# EAGLE design letter_i (EAGLE 9.5.2)
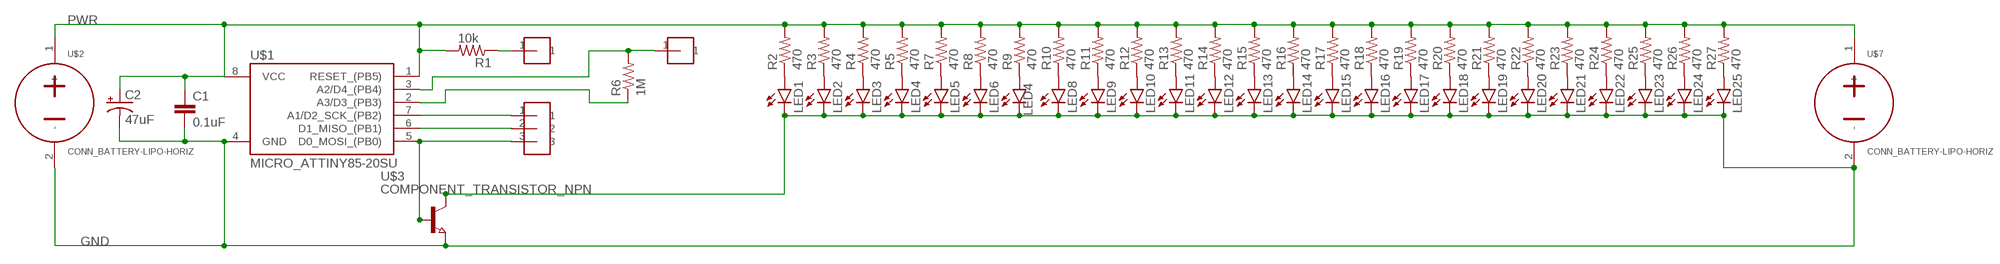
[diagram p0: schematic, sheet 1]

## Parts
C1  0.1uF  COMPONENT_CAP-0805  [0805]
C2  47uF  COMPONENT_CAP_POL-6.3MM  [CAP_RADIAL_CAN_10MM]
LED1  LED-0805  [CHIP-LED0805]
LED2  LED-0805  [CHIP-LED0805]
LED3  LED-0805  [CHIP-LED0805]
LED4  LED-0805  [CHIP-LED0805]
LED5  LED-0805  [CHIP-LED0805]
LED6  LED-0805  [CHIP-LED0805]
LED7  LED-0805  [CHIP-LED0805]
LED8  LED-0805  [CHIP-LED0805]
LED9  LED-0805  [CHIP-LED0805]
LED10  LED-0805  [CHIP-LED0805]
LED11  LED-0805  [CHIP-LED0805]
LED12  LED-0805  [CHIP-LED0805]
LED13  LED-0805  [CHIP-LED0805]
LED14  LED-0805  [CHIP-LED0805]
LED15  LED-0805  [CHIP-LED0805]
LED16  LED-0805  [CHIP-LED0805]
LED17  LED-0805  [CHIP-LED0805]
LED18  LED-0805  [CHIP-LED0805]
LED19  LED-0805  [CHIP-LED0805]
LED20  LED-0805  [CHIP-LED0805]
LED21  LED-0805  [CHIP-LED0805]
LED22  LED-0805  [CHIP-LED0805]
LED23  LED-0805  [CHIP-LED0805]
LED24  LED-0805  [CHIP-LED0805]
LED25  LED-0805  [CHIP-LED0805]
R1  10k  COMPONENT_RESISTOR-0805  [0805]
R2  470  COMPONENT_RESISTOR-0805  [0805]
R3  470  COMPONENT_RESISTOR-0805  [0805]
R4  470  COMPONENT_RESISTOR-0805  [0805]
R5  470  COMPONENT_RESISTOR-0805  [0805]
R6  1M  COMPONENT_RESISTOR-0805  [0805]
R7  470  COMPONENT_RESISTOR-0805  [0805]
R8  470  COMPONENT_RESISTOR-0805  [0805]
R9  470  COMPONENT_RESISTOR-0805  [0805]
R10  470  COMPONENT_RESISTOR-0805  [0805]
R11  470  COMPONENT_RESISTOR-0805  [0805]
R12  470  COMPONENT_RESISTOR-0805  [0805]
R13  470  COMPONENT_RESISTOR-0805  [0805]
R14  470  COMPONENT_RESISTOR-0805  [0805]
R15  470  COMPONENT_RESISTOR-0805  [0805]
R16  470  COMPONENT_RESISTOR-0805  [0805]
R17  470  COMPONENT_RESISTOR-0805  [0805]
R18  470  COMPONENT_RESISTOR-0805  [0805]
R19  470  COMPONENT_RESISTOR-0805  [0805]
R20  470  COMPONENT_RESISTOR-0805  [0805]
R21  470  COMPONENT_RESISTOR-0805  [0805]
R22  470  COMPONENT_RESISTOR-0805  [0805]
R23  470  COMPONENT_RESISTOR-0805  [0805]
R24  470  COMPONENT_RESISTOR-0805  [0805]
R25  470  COMPONENT_RESISTOR-0805  [0805]
R26  470  COMPONENT_RESISTOR-0805  [0805]
R27  470  COMPONENT_RESISTOR-0805  [0805]
U$1  MICRO_ATTINY85-20SU  [SOIC8]
U$2  CONN_BATTERY-LIPO-HORIZ  [JST-PH-2-SMT-RA]
U$3  COMPONENT_TRANSISTOR_NPN  [SOT23]
U$4  HEADER-1-TESTPOINT  [TESTPOINT-1]
U$5  HEADER-1-TESTPOINT  [TESTPOINT-1]
U$6  HEADER-3-TESTPOINT  [TESTPOINT-3]
U$7  CONN_BATTERY-LIPO-HORIZ  [JST-PH-2-SMT-RA]

## Nets
GND: C1.2 C2.- LED1.C LED2.C LED3.C LED4.C LED5.C LED6.C LED7.C LED8.C LED9.C LED10.C LED11.C LED12.C LED13.C LED14.C LED15.C LED16.C LED17.C LED18.C LED19.C LED20.C LED21.C LED22.C LED23.C LED24.C LED25.C U$1.4(GND) U$2.2(-) U$3.2(E) U$3.3(C) U$7.2(-)
N$3: LED1.A R2.1
N$4: LED2.A R3.1
N$5: LED3.A R4.1
N$6: U$1.5(D0_MOSI_(PB0)) U$3.1(B) U$6.3
N$7: LED4.A R5.1
N$8: LED5.A R7.1
N$9: LED6.A R8.1
N$10: R6.2 U$1.3(A2/D4_(PB4)) U$4.1
N$11: R1.1 U$5.1
N$12: LED7.A R9.1
N$13: U$1.7(A1/D2_SCK_(PB2)) U$6.1
N$14: U$1.6(D1_MISO_(PB1)) U$6.2
N$15: LED8.A R10.1
N$16: R6.1 U$1.2(A3/D3_(PB3))
N$17: LED9.A R11.1
N$18: LED10.A R12.1
N$19: LED11.A R13.1
N$20: LED12.A R14.1
N$21: LED13.A R15.1
N$22: LED14.A R16.1
N$23: LED15.A R17.1
N$24: LED16.A R18.1
N$25: LED17.A R19.1
N$26: LED18.A R20.1
N$27: LED19.A R21.1
N$28: LED20.A R22.1
N$29: LED21.A R23.1
N$30: LED22.A R24.1
N$31: LED23.A R25.1
N$32: LED24.A R26.1
N$33: LED25.A R27.1
PWR: C1.1 C2.+ R1.2 R2.2 R3.2 R4.2 R5.2 R7.2 R8.2 R9.2 R10.2 R11.2 R12.2 R13.2 R14.2 R15.2 R16.2 R17.2 R18.2 R19.2 R20.2 R21.2 R22.2 R23.2 R24.2 R25.2 R26.2 R27.2 U$1.1(RESET_(PB5)) U$1.8(VCC) U$2.1(+) U$7.1(+)

## Library data of the parts
C1 = homemade-hardware:COMPONENT_CAP: Capacitor Standard 0603 ceramic capacitor, and 0.1" leaded capacitor.
C2 = homemade-hardware:COMPONENT_CAP_POL: Capacitor Polarized These are standard SMD and PTH capacitors. Normally 47uF, 100uF, and 470uF in electrolytic and tantalum varieties. Always verify the external diameter of the through hole cap, it varies with capacity, voltage, and manufacturer. The EIA devices should be standard.
LED1-LED25 = homemade-hardware:LED: LEDs Standard schematic elements and footprints for 5mm, 3mm, 1206, and 0603 sized LEDs. 5mm - Spark Fun Electronics SKU : COM-00529 (and others)
R1-R27 = homemade-hardware:COMPONENT_RESISTOR
U$1 = homemade-hardware:MICRO_ATTINY85
U$2 U$7 = homemade-hardware:CONN_BATTERY
U$3 = homemade-hardware:COMPONENT_TRANSISTOR_NPN: BSS806NH6327XTSA1 <https://www.digikey.com/product-detail/en/infineon-technologies/BSS806NH6327XTSA1/BSS806NH6327XTSA1DKR-ND/3196843>: NPN Moseft Transistor - 20V 2.3A; PN: BSS806NH6327XTSA1
U$4 U$5 = homemade-hardware:HEADER-1: M20-8890845 <https://www.digikey.com/products/en?keywords=952-3236-ND>: Horizontal Male SMD Headers M20-7910842R <https://www.digikey.com/product-detail/en/harwin-inc/M20-7910842R/952-3200-6-ND/6559341>: Horizontal Female SMD Headers
U$6 = homemade-hardware:HEADER-3: NPTC081KFXC-RC <https://www.digikey.com/product-detail/en/sullins-connector-solutions/NPTC081KFXC-RC/S5600-ND/776058>: Vertical Female SMD Headers TSM-110-01-T-SV <https://www.digikey.com/product-detail/en/samtec-inc/TSM-110-01-T-SV/SAM12267-ND/6691889>: Vertical Male SMD Headers M20-8890845 <https://www.digikey.com/products/en?keywords=952-3236-ND>: Horizontal Male SMD Headers M20-7910842R <https://www.digikey.com/product-detail/en/harwin-inc/M20-7910842R/952-3200-6-ND/6559341>: Horizontal Female SMD Headers

## Board
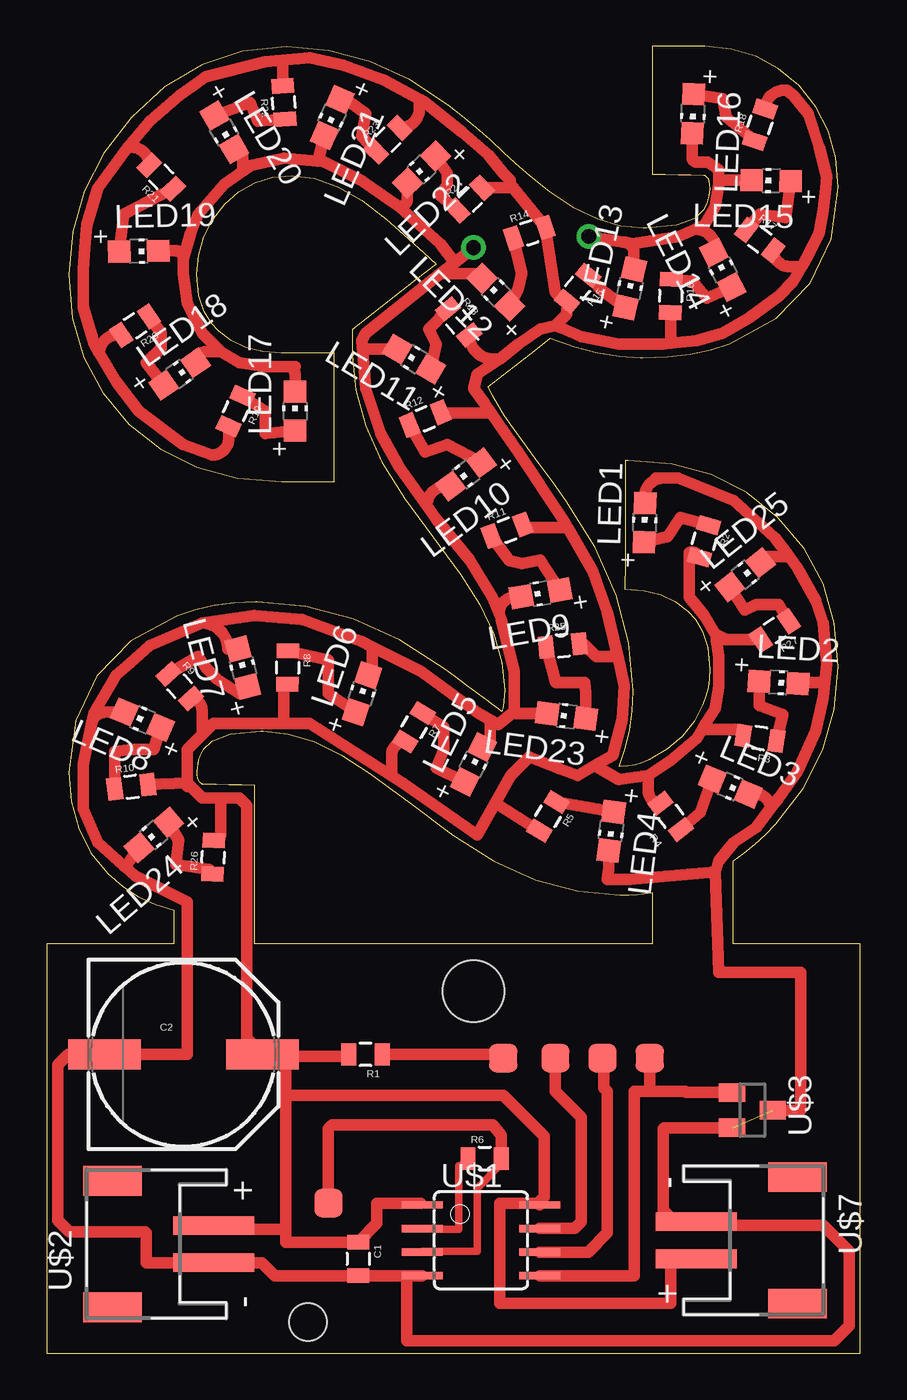
[diagram p1: board, top side]
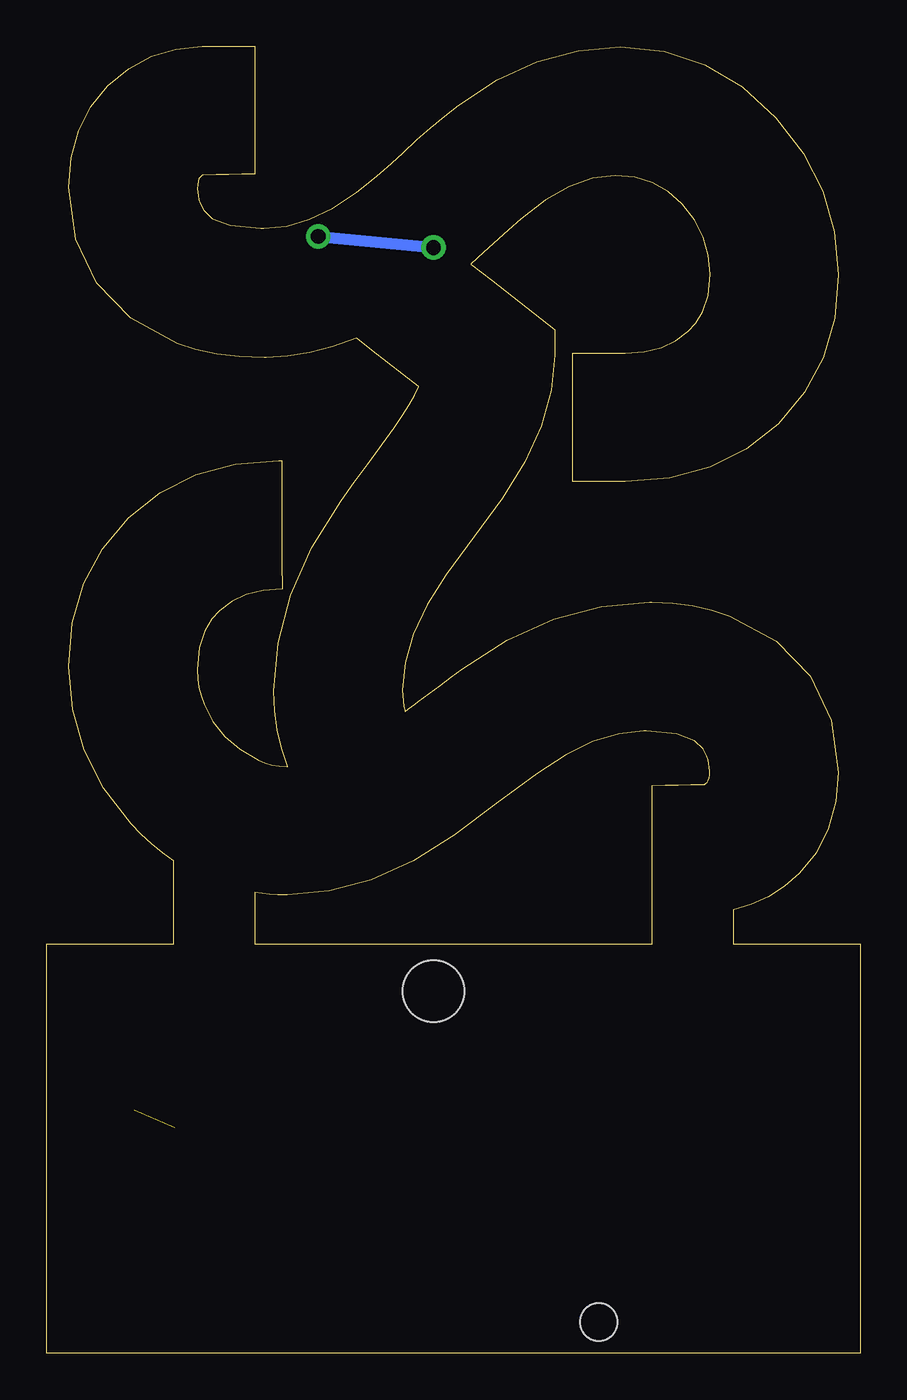
[diagram p2: board, bottom side, seen from below]

Size 43.74 x 70.28 mm. Coordinates in mm from the lower left corner, seen from the top.
Outline: 31.11,43.92 31.11,44.21 31.11,44.51 31.11,44.8 31.12,45.09 31.12,48.02 31.28,48.02 31.28,48.02 33.61,47.82 35.74,47.24 37.64,46.28 39.32,44.95 40.73,43.29 41.75,41.39 42.36,39.27 42.57,36.94 42.35,34.62 41.72,32.43 40.67,30.38 39.21,28.47 38.66,27.9 38.1,27.38 37.52,26.91 36.92,26.48 36.92,22.02 43.74,22.02 43.74,0 0,0 0,22.02 6.82,22.02 6.82,23.84 5.85,24.12 4.94,24.54 4.08,25.1 3.29,25.79 2.38,26.91 1.72,28.21 1.31,29.66 1.18,31.23 1.56,34.04 2.69,36.41 4.52,38.3 7.02,39.66 7.99,39.98 9.01,40.21 10.09,40.35 11.21,40.4 11.31,40.4 13.92,40.16 16.47,39.48 18.97,38.35 21.4,36.79 21.99,36.35 22.58,35.92 23.17,35.49 23.76,35.05 23.94,34.91 24.12,34.78 24.3,34.64 24.48,34.51 24.54,34.78 24.58,35.06 24.61,35.36 24.62,35.67 24.47,37.15 24.03,38.69 23.3,40.27 22.28,41.88 21.52,42.91 20.77,43.93 20.01,44.95 19.26,45.98 18.03,47.93 17.15,49.87 16.62,51.79 16.44,53.68 16.44,55.05 19.82,57.7 20.95,58.58 20.27,59.19 18.92,60.4 18.24,61 16.93,62.02 15.65,62.75 14.4,63.19 13.18,63.34 12.12,63.25 11.18,62.96 10.34,62.48 9.58,61.8 8.91,60.93 8.44,60.03 8.16,59.07 8.07,58.04 8.18,56.88 8.47,56.02 8.84,55.4 9.24,54.97 9.91,54.45 10.7,54.09 11.61,53.87 12.64,53.8 15.46,53.8 15.46,46.88 12.64,46.88 10.25,47.08 8.08,47.66 6.13,48.63 4.42,49.98 3.01,51.66 1.99,53.56 1.38,55.67 1.18,58 1.39,60.31 2.02,62.5 3.07,64.55 4.54,66.46 6.36,68.12 8.36,69.3 10.55,70.02 12.9,70.26 15.17,70.06 17.38,69.47 19.53,68.49 21.59,67.13 22.35,66.54 23.1,65.92 23.85,65.26 24.58,64.58 25.18,64.02 25.8,63.47 26.43,62.95 27.07,62.46 28.36,61.6 29.62,60.99 30.85,60.62 32.08,60.5 32.23,60.5 33.89,60.66 34.85,61.03 35.31,61.48 35.49,61.84 35.56,62.05 35.61,62.26 35.64,62.46 35.65,62.65 35.64,62.85 35.61,63.03 35.57,63.16 35.5,63.25 35.45,63.31 35.41,63.34 35.38,63.36 35.38,63.36 35.37,63.36 35.36,63.36 35.35,63.37 35.33,63.37 34.64,63.38 33.95,63.39 33.26,63.41 32.57,63.42 32.57,70.28 35.39,70.28 36.8,70.15 38.12,69.75 39.35,69.09 40.45,68.17 41.37,67.04 42.03,65.75 42.43,64.3 42.57,62.72 42.18,59.92 41.06,57.55 39.22,55.66 36.72,54.3 35.72,53.98 34.61,53.74 33.39,53.6 32.05,53.56 31.95,53.56 30.79,53.62 29.59,53.82 28.36,54.14 27.09,54.58 26.25,53.93 25.41,53.28 24.58,52.63 23.74,51.98 23.96,51.53 24.25,51.01 24.62,50.43 25.07,49.77 26.49,47.82 27.2,46.84 27.91,45.86 29.48,43.33 30.61,40.77 31.3,38.19 31.53,35.61 31.49,34.54 31.35,33.51 31.11,32.52 30.79,31.56 30.8,31.56 30.81,31.56 30.83,31.56 30.84,31.56 30.85,31.56 31.25,31.57 31.64,31.63 32.01,31.74 32.37,31.9 33.36,32.48 34.18,33.17 34.82,33.97 35.29,34.88 35.45,35.33 35.56,35.79 35.63,36.27 35.65,36.76 35.54,37.96 35.25,38.85 34.87,39.48 34.48,39.91 33.8,40.43 33.01,40.8 32.11,41.02 31.09,41.1 31.1,42.51 31.1,43.22 31.11,43.92
Outline: 31.11,43.92 31.11,43.92
Outline: 31.11,43.92 31.11,43.92
Outline: 31.11,43.92 31.11,43.92
Outline: 31.11,43.92 31.11,43.92
Outline: 31.11,43.92 31.11,43.92
Outline: 11.18,23.67 11.18,23.67 11.18,30.54 10.49,30.55 9.8,30.56 9.1,30.58 8.41,30.59 8.39,30.59 8.38,30.59 8.37,30.59 8.37,30.6 8.35,30.6 8.33,30.62 8.29,30.66 8.24,30.7 8.18,30.8 8.13,30.93 8.11,31.1 8.1,31.31 8.11,31.5 8.14,31.7 8.19,31.91 8.25,32.12 8.43,32.48 8.9,32.93 9.86,33.3 11.52,33.46 11.64,33.46 12.98,33.31 14.38,32.88 15.85,32.17 17.37,31.19 18.47,30.37 19.56,29.56 21.75,27.93 21.76,27.92 21.78,27.91 21.78,27.9 24.04,26.48 26.29,25.46 28.55,24.85 30.8,24.64 30.9,24.64 31.32,24.65 31.74,24.68 32.16,24.72 32.57,24.77 32.57,22.02 11.18,22.02 11.18,23.67
Copper layers (1*16): Top 0.035mm / dielectric 1.5mm / Bottom 0.035mm
Design rules "default": minimum track width 16mil, minimum drill 0.8mm, track to track 0.8mm, track to pad 0.8mm, pad to pad 0.8mm, via to via 0.8mm, smd to smd 0mil, copper to edge 1mil, drill to drill 1mil, minimum pad ring 10mil, minimum via ring 10mil, stop-mask expansion 1mil, vias tented up to drill 30mil, thermal gap 10mil
Holes 3.3 mm at 22.95,19.47
Holes 2 mm at 14.05,1.67

### Footprints (pad centres in the part's own frame; a part is rotated, then mirrored left to right if it is on the bottom)
0805 = smd 0.8 x 1.2: 1 -0.9,0; 2 0.9,0
CAP_RADIAL_CAN_10MM = smd 3.9 x 1.6: + 4.25,0; - -4.25,0
CHIP-LED0805 = smd 1.2 x 1.2: A 0,-1.05; C 0,1.05
SOIC8 = smd 0.4 x 2.2: 1 -1.905,-3.154; 2 -0.635,-3.154; 3 0.635,-3.154; 4 1.905,-3.154; 5 1.905,3.154; 6 0.635,3.154; 7 -0.635,3.154; 8 -1.905,3.154
JST-PH-2-SMT-RA = smd 1 x 4.35: 1 1,-3.825; 2 -1,-3.825 | smd 1.6 x 3.15: NC1 -3.4,1.625; NC2 3.4,1.625
SOT23 = smd 1 x 1.4: 1 -0.95,-1.1; 2 0.95,-1.1; 3 0,1.1
TESTPOINT-1 = smd 1.524 x 1.524: 1 0,0
TESTPOINT-3 = smd 1.524 x 1.524: 1 0,0; 2 2.54,0; 3 5.08,0

### Placement (x,y rotation side)
C1  16.75,5.07 270 top
C2  7.35,16.07 0 top
LED1  32.15,44.67 358.4 top
LED2  39.35,36.07 266.7 top
LED3  36.75,30.47 247.3 top
LED4  30.35,28.07 172.8 top
LED5  22.95,31.67 333.5 top
LED6  16.95,35.47 341.5 top
LED7  10.55,36.87 14.5 top
LED8  5.15,34.07 66.8 top
LED9  26.55,40.87 100 top
LED10  22.55,47.27 126.8 top
LED11  19.75,53.47 59.1 top
LED12  24.15,57.07 45 top
LED13  31.35,57.27 347.4 top
LED14  36.35,58.27 26.9 top
LED15  38.95,63.07 89.1 top
LED16  34.75,66.67 177.9 top
LED17  13.35,50.67 0 top
LED18  7.15,52.67 305 top
LED19  4.95,59.27 271.3 top
LED20  9.55,65.67 210.4 top
LED21  15.35,66.47 156.1 top
LED22  20.15,63.67 134.1 top
LED23  27.95,34.27 82.4 top
LED24  5.75,27.87 130.7 top
LED25  37.55,41.87 308.4 top
R1  17.15,16.07 180 top
R2  35.35,43.67 254.1 top
R3  38.35,33.07 171 top
R4  33.55,28.87 127.8 top
R5  26.95,28.87 239.1 top
R6  23.55,10.47 0 top
R7  19.75,33.67 238.4 top
R8  12.95,36.87 269.3 top
R9  7.15,35.87 312.1 top
R10  4.55,30.47 7.1 top
R11  24.75,44.27 20.2 top
R12  20.35,50.27 22.1 top
R13  22.15,55.47 309.3 top
R14  25.95,60.27 18.5 top
R15  28.55,57.27 230.7 top
R16  33.55,56.87 268.3 top
R17  38.35,59.87 322.6 top
R18  38.35,66.07 71.5 top
R19  10.15,50.67 245.9 top
R20  4.75,55.27 213.7 top
R21  6.15,63.27 135 top
R22  12.75,67.27 93.9 top
R23  18.35,65.27 45 top
R24  22.75,62.07 43 top
R25  27.75,38.07 5.9 top
R26  8.95,26.67 87.6 top
R27  39.15,38.87 213.2 top
U$1  23.35,6.07 270 top
U$2  5.15,5.87 90 top
U$3  37.95,13.07 270 top
U$4  15.15,8.07 0 top
U$5  24.55,15.87 0 top
U$6  27.35,15.87 0 top
U$7  38.75,6.07 270 top

### Tracks (layer width: path | path; a pad name or v marks a point on that pad's centre or on a via)
GND  (via drill 0.8)  (1 unrouted)
  Top 0.508: 5.35,6.47 5.3,6.51 | 34.9,7.04 U$7.2 33.75,7.07
  Top 0.61: U$2.2 5.35,4.87 5.35,6.47 | 5.3,6.51 1.21,6.51 0.6,7.13 0.6,15.51 1.15,16.07 C2.- 7.55,16.07 7.55,24.27 4.75,25.67 4.21,26.15 | U$2.2 9.17,5.07 | U$3.2 33.2,12.12 33.15,12.07 33.15,7.67 33.75,7.07 33.95,6.87 41.75,6.87 43.15,5.47 43.15,1.47 42.35,0.67 19.35,0.67 19.35,3.97 19.15,4.17 | U$2.2 11.55,4.87 12.25,4.17 C1.2 19.15,4.17 | 2.38,33.66 1.95,31.67 1.95,29.27 2.75,27.47 4.12,26.23 4.21,26.15 | 2.38,33.66 2.55,34.47 3.75,36.47 4.49,37.13 5.55,38.07 8.35,39.27 | 8.35,39.27 11.15,39.67 13.75,39.47 16.95,38.27 17.51,37.99 | 17.51,37.99 20.15,36.67 23.15,34.47 23.86,34.06 | 23.86,34.06 24.29,33.82 25.15,34.51 | 25.15,34.51 25.15,36.67 24.45,39.47 24.32,39.77 | 24.32,39.77 23.95,40.67 22.75,42.67 20.95,44.87 20.44,45.59 | 20.44,45.59 18.95,47.67 18.04,49.3 17.95,49.47 17.15,51.87 17,53.85 | 17,53.85 16.95,54.47 17.15,54.87 21.15,58.07 | 21.15,58.07 21.95,58.67 | 21.95,58.67 21.15,59.67 18.95,61.67 | 18.95,61.67 18.36,62.08 16.95,63.07 14.95,64.07 14.59,64.15 | 10.55,63.58 10.95,63.87 12.75,64.27 14.58,64.1 14.59,64.15 | 10.55,63.58 9.55,62.87 8.15,61.27 7.75,60.27 7.35,58.87 | 7.35,58.87 7.35,58.07 7.55,56.47 8.35,54.87 9.35,53.87 | 9.35,53.87 10.35,53.27 11.75,53.07 12.95,53.07 | 12.95,53.07 13.35,53.07 | U$3.3 40.55,13.07 40.55,20.47 36.15,20.47 35.95,25.87 | 35.95,25.87 31.35,25.47 30.15,25.47 30.22,26.05 LED4.C | 35.95,25.87 36.15,26.47 36.95,27.47 38.15,28.27 38.92,29.29 | 38.92,29.29 39.35,29.87 40.35,31.27 41.35,33.47 41.75,35.27 41.84,36.06 | 41.84,36.06 41.95,37.07 41.75,39.27 41.35,40.47 40.35,42.27 39.92,42.84 | 39.92,42.84 39.15,43.87 36.95,45.87 33.95,47.07 33.15,47.07
  Top 0.61: 33.15,47.07 32.75,47.07 | 21.95,58.67 v22.95,59.47 | v29.15,60.07 31,59.76 | 31,59.76 31.55,59.67 33.95,60.07 34.87,60.46 | 34.87,60.46 35.35,60.67 35.95,61.67 36.15,62.87 36.15,63.08 | 36.15,63.08 36.15,63.67 35.55,64.07 34.95,64.07 arc-90 34.71,64.3 LED16.C | 38.92,29.29 arc90 38.15,30.06 LED3.C | 41.84,36.06 40.45,36.06 arc-90 LED2.C | 39.92,42.84 38.7,42.84 arc90 LED25.C | 33.15,47.07 arc90 32.15,46.06 LED1.C | 2.38,33.66 arc-90 3.2,34.48 LED8.C | 8.35,39.27 arc-90 9.73,37.88 LED7.C | 17.51,37.99 17.51,36.69 arc-90 LED6.C | 23.86,34.06 23.86,33.05 arc-90 LED5.C | 25.15,34.51 arc90 25.25,34.41 LED23.C | 24.32,39.77 arc-90 25.23,40.68 LED9.C | 20.44,45.59 arc-90 21.49,46.64 LED10.C | 17,53.85 arc-90 17.15,54.01 LED11.C | 21.15,58.07 23.15,58.07 arc-90 LED12.C | 31,59.76 arc-90 31.58,59.18 LED13.C | 34.87,60.46 arc-90 35.98,59.35 LED14.C | LED15.C 36.15,63.08 | 18.95,61.67 arc90 19.4,62.11 LED22.C | 14.59,64.15 LED21.C | 10.55,63.58 10.55,64.29 arc90 LED20.C | 7.35,58.87 arc90 6.93,59.29 LED19.C | 9.35,53.87 8.61,53.87 arc90 LED18.C | 12.95,53.07 arc-90 13.35,52.67 LED17.C | U$1.4 19.15,4.17 | 4.21,26.15 LED24.C
  Bottom 0.61: v22.95,59.47 v29.15,60.07
N$3
  Top 0.61: LED1.A 33.39,43.92 34.07,44.94 R2.1
N$4
  Top 0.61: R3.1 39.57,34.34 38.3,34.85 LED2.A
N$5
  Top 0.61: R4.1 35.15,29.07 LED3.A
N$6
  Top 0.61: U$1.5 31.6,4.16 31.6,14.07 32.55,14.07 | U$3.1 34.4,14.02 34.35,14.07 32.55,14.07 | 32.55,14.07 32.43,14.19 U$6.3
N$7
  Top 0.61: R5.1 LED4.A
N$8
  Top 0.61: LED5.A 20.95,31.47 21.35,32.47 21.35,33.67 20.75,34.07 R7.1
N$9
  Top 0.61: LED6.A 15.15,35.47 15.15,37.27 R8.1
N$10
  Top 0.406: R6.2 24.45,10.17 23.15,8.87 23.15,5.47 20.23,5.47 U$1.3
  Top 0.61: R6.2 24.45,11.71 23.99,12.27 15.35,12.27 15.15,12.07 U$4.1
N$11
  Top 0.61: R1.1 24.35,16.07 U$5.1
N$12
  Top 0.61: R9.1 8.15,37.47 8.55,36.87 9.15,36.27 10.35,35.47 LED7.A
N$13
  Top 0.61: U$1.7 28.38,6.7 28.75,7.07 28.75,12.67 27.35,14.07 U$6.1
N$14
  Top 0.61: U$1.6 29.11,5.43 30.15,6.47 30.15,14.07 29.95,14.27 29.95,15.27 U$6.2
N$15
  Top 0.61: R10.1 3.67,32.37 4.55,32.47 5.75,32.47 LED8.A
N$16
  Top 0.406: R6.1 22.25,10.07 22.15,10.07 22.15,6.67 21.15,6.67 | 21.15,6.67 20.95,6.67 | U$1.2 21.15,6.67
N$17
  Top 0.61: R11.1 24.86,42.64 25.55,42.47 26.55,42.67 LED9.A
N$18
  Top 0.61: R12.1 20.35,48.47 21.55,48.87 LED10.A
N$19
  Top 0.61: LED11.A 20.95,54.27 20.55,55.07 R13.1
N$20
  Top 0.61: LED12.A 25.35,57.27 25.55,58.07 R14.1
N$21
  Top 0.61: R15.1 29.75,57.27 LED13.A
N$22
  Top 0.61: LED14.A 35.48,56.75 34.75,57.67 R16.1
N$23
  Top 0.61: R17.1 38.35,61.27 39.75,61.07 LED15.A
N$24
  Top 0.61: LED16.A 36.35,67.47 36.55,66.47 R18.1
N$25
  Top 0.61: LED17.A 11.75,49.47 11.75,50.67 R19.1
N$26
  Top 0.61: LED18.A 5.35,53.27 6.15,54.07 6.15,54.87 R20.1
N$27
  Top 0.61: LED19.A 4.15,61.27 R21.1
N$28
  Top 0.61: R22.1 11.35,66.27 10.95,67.27 LED20.A
N$29
  Top 0.61: R23.1 16.95,65.47 17.15,66.67 16.35,67.27 LED21.A
N$30
  Top 0.61: R24.1 21.15,62.27 21.55,62.87 21.55,63.47 LED22.A
N$31
  Top 0.61: R25.1 27.36,36.07 28.92,36.07 28.99,35.54 LED23.A
N$32
  Top 0.61: LED24.A 7.09,27.57 6.92,26.27 8.75,26 R26.1
N$33
  Top 0.61: LED25.A 37.55,39.97 38.15,40.27 39.35,40.27 R27.1
PWR
  Top 0.406: 20.1,8.07 U$1.1
  Top 0.61: 12.85,13.87 12.85,15.97 13.55,15.97 | 12.85,13.87 12.85,6.67 | 12.85,6.67 12.85,5.97 C1.1 17.75,6.97 17.75,8.07 20.1,8.07 | 26.41,8.07 U$1.8 | 26.41,8.07 24.35,8.07 24.35,2.67 33.55,2.67 33.55,5.07 U$7.1 | R1.2 16.22,15.97 13.55,15.97 | U$2.1 9.17,6.67 12.85,6.67 | 12.85,13.87 24.55,13.87 26.75,11.67 26.75,8.41 26.41,8.07 | 9.35,29.87 10.35,29.87 10.75,29.47 10.75,16.92 C2.+ 13.55,15.97 | 9.35,29.87 8.35,29.87 7.55,30.67 | 7.55,30.67 7.55,32.47 8.35,33.27 | 7.55,30.67 7.55,30.47 | 8.35,33.27 8.95,33.87 12.75,33.87 | 12.75,33.87 14.15,33.87 18.54,31.06 | 18.54,31.06 19.15,30.67 23.15,27.87 23.99,29.36 24.12,29.59 | 24.12,29.59 24.95,31.07 25.95,32.07 27.54,31.45 28.55,31.07 29.48,31.6 | 29.48,31.6 30.42,32.14 30.95,34.07 31.06,35.9 30.75,37.27 30.7,37.47 | 30.7,37.47 30.15,39.87 29.35,42.07 28.02,44.39 | 28.02,44.39 27.75,44.87 25.35,48.47 24.31,49.97 23.89,50.57 | 23.89,50.57 23.55,51.07 22.95,51.87 23.15,52.67 24.35,53.47 | 24.35,53.47 25.35,54.27 26.55,55.07 27.35,55.27 | 27.35,55.27 27.55,55.18 27.69,55.12 28.75,54.67 30.75,54.27 33.15,54.27 33.57,54.31 | 33.57,54.31 34.95,54.47 36.35,54.87 37.75,55.67 39.35,56.87 40.15,57.67 40.59,58.44 | 40.59,58.44 40.95,59.07 41.55,60.27 41.75,61.47 41.88,62.67 41.95,63.27 41.55,64.87 40.95,66.67 40.15,67.67 39.79,67.92 39.64,67.92 arc90 R18.2 | 27.35,55.27 27.96,55.88 R15.2 27.85,56.55 27.33,57.06 R14.2 24.94,62.89 | 24.94,62.89 24.93,63.09 24.55,63.47 23.75,64.47 22.35,65.67 20.35,67.27 20.04,67.43 | 20.04,67.43 18.15,68.47 15.95,69.27 14.15,69.67 12.35,69.52 | 12.35,69.52 11.75,69.47 8.55,68.67 7.87,68.18 7.15,67.67 5.55,66.27 4.35,64.87
  Top 0.61: 4.35,64.87 2.75,62.67 2.15,60.67 2.05,59.47 1.95,58.27 1.95,56.27 2.55,54.27 2.83,53.8 | 2.83,53.8 3.75,52.27 4.95,50.67 7.35,48.87 8.89,48.31 arc90 9.78,49.2 R19.2 | 29.48,31.6 30.75,30.87 32.35,31.07 | 32.35,31.07 33.55,31.87 34.95,33.07 35.24,33.53 | 35.24,33.53 35.48,33.91 35.95,34.67 36.15,35.87 36.15,37.47 36.08,37.86 36,38.37 36.55,38.37 | 2.83,53.8 arc-90 3.8,54.77 R20.2 | 4.35,64.87 4.55,64.87 arc-90 R21.2 | 12.35,69.52 arc-90 12.69,69.17 R22.2 | 20.04,67.43 20.04,66.96 arc-90 R23.2 | 24.94,62.89 arc-90 24.73,62.68 R24.2 | 33.57,54.31 33.57,55.92 arc90 R16.2 | 40.59,58.44 39.94,58.44 arc-90 R17.2 | 24.35,53.47 24.02,53.47 arc-90 R13.2 | 23.89,50.57 21.2,50.57 arc-90 R12.2 | 28.02,44.39 25.78,44.39 arc90 R11.2 | 30.7,37.47 29.54,37.47 28.84,38.16 arc-90 R25.2 | R5.2 24.12,29.59 | 32.35,31.07 32.35,30.23 arc90 R4.2 | 35.24,33.53 37.13,33.53 arc-90 R3.2 | 36.55,38.37 R27.2 | R2.2 arc90 34.55,43.05 34.55,40.67 35.35,39.67 35.95,38.67 36.55,38.37 | 9.35,29.87 9.35,27.94 arc-90 R26.2 | 8.35,33.27 8.35,34.6 arc90 R9.2 | 12.75,33.87 12.75,35.78 arc-90 R8.2 | 18.54,31.06 18.54,32.16 arc-90 R7.2 | R10.2 7.55,30.67